# Altium schematic sheet MCU64.SchDoc
size A3
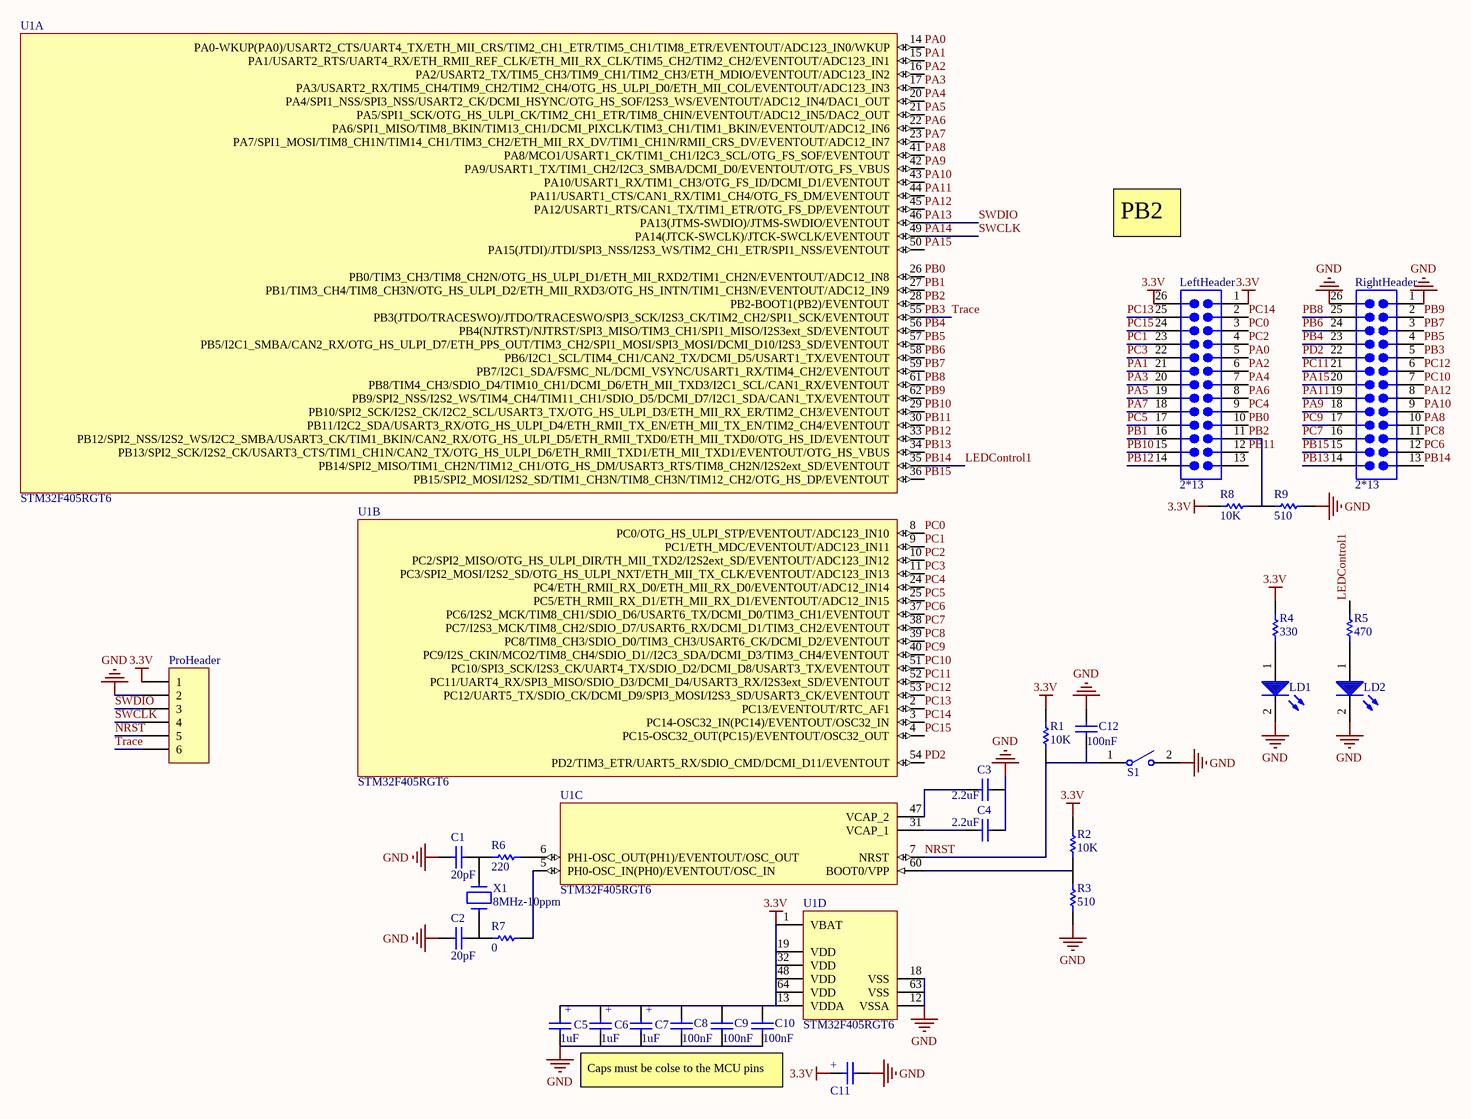
[diagram p0: MCU64.SchDoc]

## Parts
C1  20pF  [SMD 805 CAP]
C2  20pF  [SMD 805 CAP]
C3  2.2uF  [SMD 805 CAP]
C4  2.2uF  [SMD 805 CAP]
C5  1uF  [MY_CAP_SMD-A]
C6  1uF  [MY_CAP_SMD-A]
C7  1uF  [MY_CAP_SMD-A]
C8  100nF  [SMD 805 CAP]
C9  100nF  [SMD 805 CAP]
C10  100nF  [SMD 805 CAP]
C11  Cap  [MY_CAP_SMD-D]  (value not drawn)
C12  100nF  [SMD 805 CAP]
LD1  150080BS75000  [LED_0805_Blue]  (value not drawn)
LD2  150080BS75000  [LED_0805_Blue]  (value not drawn)
LeftHeader  2*13  [61302621121]
ProHeader  WE-2.54 mm Pin Header & Jumper 61300611121  [61300611121]  (value not drawn)
R1  10K  [SMD 805]
R2  10K  [SMD 805]
R3  510  [SMD 805]
R4  330  [SMD 805]
R5  470  [SMD 805]
R6  220  [SMD 805]
R7  0  [SMD 805]
R8  10K  [SMD 805]
R9  510  [SMD 805]
RightHeader  2*13  [61302621121]
S1  Tact Switch  [4341x10438x6]  (value not drawn)
U1  STM32F405RGT6  [TQFP64_V]  (parts A,B,C,D of 4)
X1  8MHz-10ppm  [My_Crystal]

## Nets
3.3V: C5.+ C6.+ C7.+ C8.2 C9.2 C10.2 C11.+ LeftHeader.1 LeftHeader.26 ProHeader.1 R1.2 R2.2 R4.2 R8.2 U1.1(VBAT) U1.13(VDDA) U1.19(VDD) U1.32(VDD) U1.48(VDD) U1.64(VDD)
GND: C1.1 C2.1 C3.2 C4.2 C5.- C6.- C7.- C8.1 C9.1 C10.1 C11.- C12.2 LD1.2(C) LD2.2(C) ProHeader.2 R3.1 R9.1 RightHeader.1 RightHeader.26 S1.2 U1.12(VSSA) U1.18(VSS) U1.63(VSS)
LEDControl1: R5.2 RightHeader.13 U1.35(PB14/SPI2_MISO/TIM1_CH2N/TIM12_CH1/OTG_HS_DM/USART3_RTS/TIM8_CH2N/I2S2ext_SD/EVENTOUT)  [also labelled PB14]
NRST: C12.1 ProHeader.5 R1.1 S1.1 U1.7(NRST)
PA0: LeftHeader.5 U1.14(PA0-WKUP(PA0)/USART2_CTS/UART4_TX/ETH_MII_CRS/TIM2_CH1_ETR/TIM5_CH1/TIM8_ETR/EVENTOUT/ADC123_IN0/WKUP)
PA1: LeftHeader.21 U1.15(PA1/USART2_RTS/UART4_RX/ETH_RMII_REF_CLK/ETH_MII_RX_CLK/TIM5_CH2/TIM2_CH2/EVENTOUT/ADC123_IN1)
PA2: LeftHeader.6 U1.16(PA2/USART2_TX/TIM5_CH3/TIM9_CH1/TIM2_CH3/ETH_MDIO/EVENTOUT/ADC123_IN2)
PA3: LeftHeader.20 U1.17(PA3/USART2_RX/TIM5_CH4/TIM9_CH2/TIM2_CH4/OTG_HS_ULPI_D0/ETH_MII_COL/EVENTOUT/ADC123_IN3)
PA4: LeftHeader.7 U1.20(PA4/SPI1_NSS/SPI3_NSS/USART2_CK/DCMI_HSYNC/OTG_HS_SOF/I2S3_WS/EVENTOUT/ADC12_IN4/DAC1_OUT)
PA5: LeftHeader.19 U1.21(PA5/SPI1_SCK/OTG_HS_ULPI_CK/TIM2_CH1_ETR/TIM8_CHIN/EVENTOUT/ADC12_IN5/DAC2_OUT)
PA6: LeftHeader.8 U1.22(PA6/SPI1_MISO/TIM8_BKIN/TIM13_CH1/DCMI_PIXCLK/TIM3_CH1/TIM1_BKIN/EVENTOUT/ADC12_IN6)
PA7: LeftHeader.18 U1.23(PA7/SPI1_MOSI/TIM8_CH1N/TIM14_CH1/TIM3_CH2/ETH_MII_RX_DV/TIM1_CH1N/RMII_CRS_DV/EVENTOUT/ADC12_IN7)
PA8: RightHeader.10 U1.41(PA8/MCO1/USART1_CK/TIM1_CH1/I2C3_SCL/OTG_FS_SOF/EVENTOUT)
PA9: RightHeader.18 U1.42(PA9/USART1_TX/TIM1_CH2/I2C3_SMBA/DCMI_D0/EVENTOUT/OTG_FS_VBUS)
PA10: RightHeader.9 U1.43(PA10/USART1_RX/TIM1_CH3/OTG_FS_ID/DCMI_D1/EVENTOUT)
PA11: RightHeader.19 U1.44(PA11/USART1_CTS/CAN1_RX/TIM1_CH4/OTG_FS_DM/EVENTOUT)
PA12: RightHeader.8 U1.45(PA12/USART1_RTS/CAN1_TX/TIM1_ETR/OTG_FS_DP/EVENTOUT)
PA13: ProHeader.3 U1.46(PA13(JTMS-SWDIO)/JTMS-SWDIO/EVENTOUT)  [also labelled SWDIO]
PA14: ProHeader.4 U1.49(PA14(JTCK-SWCLK)/JTCK-SWCLK/EVENTOUT)  [also labelled SWCLK]
PA15: RightHeader.20 U1.50(PA15(JTDI)/JTDI/SPI3_NSS/I2S3_WS/TIM2_CH1_ETR/SPI1_NSS/EVENTOUT)
PB0: LeftHeader.10 U1.26(PB0/TIM3_CH3/TIM8_CH2N/OTG_HS_ULPI_D1/ETH_MII_RXD2/TIM1_CH2N/EVENTOUT/ADC12_IN8)
PB1: LeftHeader.16 U1.27(PB1/TIM3_CH4/TIM8_CH3N/OTG_HS_ULPI_D2/ETH_MII_RXD3/OTG_HS_INTN/TIM1_CH3N/EVENTOUT/ADC12_IN9)
PB2: LeftHeader.11 R8.1 R9.2 U1.28(PB2-BOOT1(PB2)/EVENTOUT)
PB3: ProHeader.6 RightHeader.5 U1.55(PB3(JTDO/TRACESWO)/JTDO/TRACESWO/SPI3_SCK/I2S3_CK/TIM2_CH2/SPI1_SCK/EVENTOUT)  [also labelled Trace]
PB4: RightHeader.23 U1.56(PB4(NJTRST)/NJTRST/SPI3_MISO/TIM3_CH1/SPI1_MISO/I2S3ext_SD/EVENTOUT)
PB5: RightHeader.4 U1.57(PB5/I2C1_SMBA/CAN2_RX/OTG_HS_ULPI_D7/ETH_PPS_OUT/TIM3_CH2/SPI1_MOSI/SPI3_MOSI/DCMI_D10/I2S3_SD/EVENTOUT)
PB6: RightHeader.24 U1.58(PB6/I2C1_SCL/TIM4_CH1/CAN2_TX/DCMI_D5/USART1_TX/EVENTOUT)
PB7: RightHeader.3 U1.59(PB7/I2C1_SDA/FSMC_NL/DCMI_VSYNC/USART1_RX/TIM4_CH2/EVENTOUT)
PB8: RightHeader.25 U1.61(PB8/TIM4_CH3/SDIO_D4/TIM10_CH1/DCMI_D6/ETH_MII_TXD3/I2C1_SCL/CAN1_RX/EVENTOUT)
PB9: RightHeader.2 U1.62(PB9/SPI2_NSS/I2S2_WS/TIM4_CH4/TIM11_CH1/SDIO_D5/DCMI_D7/I2C1_SDA/CAN1_TX/EVENTOUT)
PB10: LeftHeader.15 U1.29(PB10/SPI2_SCK/I2S2_CK/I2C2_SCL/USART3_TX/OTG_HS_ULPI_D3/ETH_MII_RX_ER/TIM2_CH3/EVENTOUT)
PB11: LeftHeader.12 U1.30(PB11/I2C2_SDA/USART3_RX/OTG_HS_ULPI_D4/ETH_RMII_TX_EN/ETH_MII_TX_EN/TIM2_CH4/EVENTOUT)
PB12: LeftHeader.14 U1.33(PB12/SPI2_NSS/I2S2_WS/I2C2_SMBA/USART3_CK/TIM1_BKIN/CAN2_RX/OTG_HS_ULPI_D5/ETH_RMII_TXD0/ETH_MII_TXD0/OTG_HS_ID/EVENTOUT)
PB13: RightHeader.14 U1.34(PB13/SPI2_SCK/I2S2_CK/USART3_CTS/TIM1_CH1N/CAN2_TX/OTG_HS_ULPI_D6/ETH_RMII_TXD1/ETH_MII_TXD1/EVENTOUT/OTG_HS_VBUS)
PB15: RightHeader.15 U1.36(PB15/SPI2_MOSI/I2S2_SD/TIM1_CH3N/TIM8_CH3N/TIM12_CH2/OTG_HS_DP/EVENTOUT)
PC0: LeftHeader.3 U1.8(PC0/OTG_HS_ULPI_STP/EVENTOUT/ADC123_IN10)
PC1: LeftHeader.23 U1.9(PC1/ETH_MDC/EVENTOUT/ADC123_IN11)
PC2: LeftHeader.4 U1.10(PC2/SPI2_MISO/OTG_HS_ULPI_DIR/TH_MII_TXD2/I2S2ext_SD/EVENTOUT/ADC123_IN12)
PC3: LeftHeader.22 U1.11(PC3/SPI2_MOSI/I2S2_SD/OTG_HS_ULPI_NXT/ETH_MII_TX_CLK/EVENTOUT/ADC123_IN13)
PC4: LeftHeader.9 U1.24(PC4/ETH_RMII_RX_D0/ETH_MII_RX_D0/EVENTOUT/ADC12_IN14)
PC5: LeftHeader.17 U1.25(PC5/ETH_RMII_RX_D1/ETH_MII_RX_D1/EVENTOUT/ADC12_IN15)
PC6: RightHeader.12 U1.37(PC6/I2S2_MCK/TIM8_CH1/SDIO_D6/USART6_TX/DCMI_D0/TIM3_CH1/EVENTOUT)
PC7: RightHeader.16 U1.38(PC7/I2S3_MCK/TIM8_CH2/SDIO_D7/USART6_RX/DCMI_D1/TIM3_CH2/EVENTOUT)
PC8: RightHeader.11 U1.39(PC8/TIM8_CH3/SDIO_D0/TIM3_CH3/USART6_CK/DCMI_D2/EVENTOUT)
PC9: RightHeader.17 U1.40(PC9/I2S_CKIN/MCO2/TIM8_CH4/SDIO_D1//I2C3_SDA/DCMI_D3/TIM3_CH4/EVENTOUT)
PC10: RightHeader.7 U1.51(PC10/SPI3_SCK/I2S3_CK/UART4_TX/SDIO_D2/DCMI_D8/USART3_TX/EVENTOUT)
PC11: RightHeader.21 U1.52(PC11/UART4_RX/SPI3_MISO/SDIO_D3/DCMI_D4/USART3_RX/I2S3ext_SD/EVENTOUT)
PC12: RightHeader.6 U1.53(PC12/UART5_TX/SDIO_CK/DCMI_D9/SPI3_MOSI/I2S3_SD/USART3_CK/EVENTOUT)
PC13: LeftHeader.25 U1.2(PC13/EVENTOUT/RTC_AF1)
PC14: LeftHeader.2 U1.3(PC14-OSC32_IN(PC14)/EVENTOUT/OSC32_IN)
PC15: LeftHeader.24 U1.4(PC15-OSC32_OUT(PC15)/EVENTOUT/OSC32_OUT)
PD2: RightHeader.22 U1.54(PD2/TIM3_ETR/UART5_RX/SDIO_CMD/DCMI_D11/EVENTOUT)
NetC1_2: C1.2 R6.1 X1.2
NetC2_2: C2.2 R7.1 X1.1
NetC3_1: C3.1 U1.47(VCAP_2)
NetC4_1: C4.1 U1.31(VCAP_1)
NetLD1_1: LD1.1(A) R4.1
NetLD2_1: LD2.1(A) R5.1
NetR2_1: R2.1 R3.2 U1.60(BOOT0/VPP)
NetR6_2: R6.2 U1.6(PH1-OSC_OUT(PH1)/EVENTOUT/OSC_OUT)
NetR7_2: R7.2 U1.5(PH0-OSC_IN(PH0)/EVENTOUT/OSC_IN)

Not connected (* = marked no-connect by the designer): LeftHeader 13

## Notes on the sheet
- PB2
- Caps must be colse to the MCU pins

## Library data of the parts
C1-C4 C8-C10 C12 = CAP without Pole
C5-C7 = CAP_TANTAL_A: 3.2X1.6MM; Value: 3300u
C11 = CAP_TANTAL_D: 7.3X4.3MM; Value: 3300u
LD1 LD2 = WL-SMCW 0805  150080BS75000: SMD mono-color Chip LED, WL-SMCW, Blue; Manufacturer: W黵th Elektronik eiSos GmbH; PartNo: 150080BS75000; ComponentLink1Description: Manufacturer; ComponentLink1URL: http://www.we-online.de; Created by: Christin Otto; Created Date: June 2013; ComponentLink2Description: Datasheet; ComponentLink2URL: http://katalog.we-online.com/led/datasheet/150080BS75000.pdf; Color: Blue
LeftHeader RightHeader = WE-2.54 mm Pin Header & Jumper 61302621121: WR-PHD 2.54 mm Dual Pin Header; Manufacturer: W¨¹rth Elektronik eiSos GmbH; ComponentLink1 Description: Manufacturer; ComponentLink2 Description: Datasheet; NoPins: 26; Created Date: 25 March 2013; partNo: 61302621121; ComponentLink1URL: http://www.we-online.com; ComponentLink2URL: http://katalog.we-online.de/em/datasheet/6130xx21121.pdf; Created by: Karrer Zheng
ProHeader = WE-2.54 mm Pin Header & Jumper 61300611121: WR-PHD 2.54mm Pin Header; Manufacturer: W¨¹rth Elektronik eiSos GmbH; ComponentLink1 Description: Manufacturer; ComponentLink2 Description: Datasheet; NoPins: 06; Created Date: 22 March 2013; partNo: 61300611121; ComponentLink1URL: http://www.we-online.com; ComponentLink2URL: http://katalog.we-online.de/em/datasheet/6130xx11121.pdf; Created by: Karrer Zheng
R1-R9 = Resistor
S1 = WS-TASV, 434111043826: WS-TASV 6.0x3.5 mm SMD; Manufacturer: Wurth Elektronik; partNo: 434111043826; ComponentLink1Description: Manufacturer; ComponentLink1URL: http://www.we-online.de; Created by: Baojun Chen; Created Date: Dec.2015; ComponentLink2Description: Datasheet; ComponentLink2URL: http://katalog.we-online.de/em/datasheet/4341x1xxx8x6.pdf
U1 = STM32F405RGT6: ARM Cortex-M4 32b MCU+FPU, 210DMIP, 1024 kB Flash, 192+4 kB RAM, 51 I/Os, 64-pin LQFP, -40 to +85°C, Tray; Internal RAM: 192kB; Operating Frequency (Processor Speed): 168MHz; A/D Converter: 16x12-bit; D/A Converter: 2x12-bit; 16-bit Timers (IC/OC/PWM): 12x16-bit(24/24/30); 32-bit Timer (IC/OC/PWM): 2x32-bit (8/8/8); Other Timer Functions: 2xWDG, RTC, 24-bit down counter; Serial Interface: 3xSPI/2xI2S/2xI2C/3xUSART(IrDa, ISO7816)/3xUART/1xUSB OTG FS/HS, 2xCAN/ SDIO; DatasheetVersion: rev2, Jan-2012; PackageVersion: 2012; PackageReference: TQFP64; PackageDescription: 64-Pin Low Profile Quad Flat Package, 10x10 mm Body, 0.5 mm Pitch; ComponentLink1Description: Manufacturer URL; ComponentLink1URL: http://www.st.com/; ComponentLink2Description: STM32F405/7 Datasheet; ComponentLink2URL: http://www.st.com/internet/com/TECHNICAL_RESOURCES/TECHNICAL_LITERATURE/DATASHEET/DM00037051.pdf; ComponentLink3Description: STM32F4 Web Page; ComponentLink3URL: http://www.st.com/internet/mcu/subclass/1521.jsp
X1 = CRYSTAL